# EAGLE design FeatherRTC (EAGLE 9.2.2)
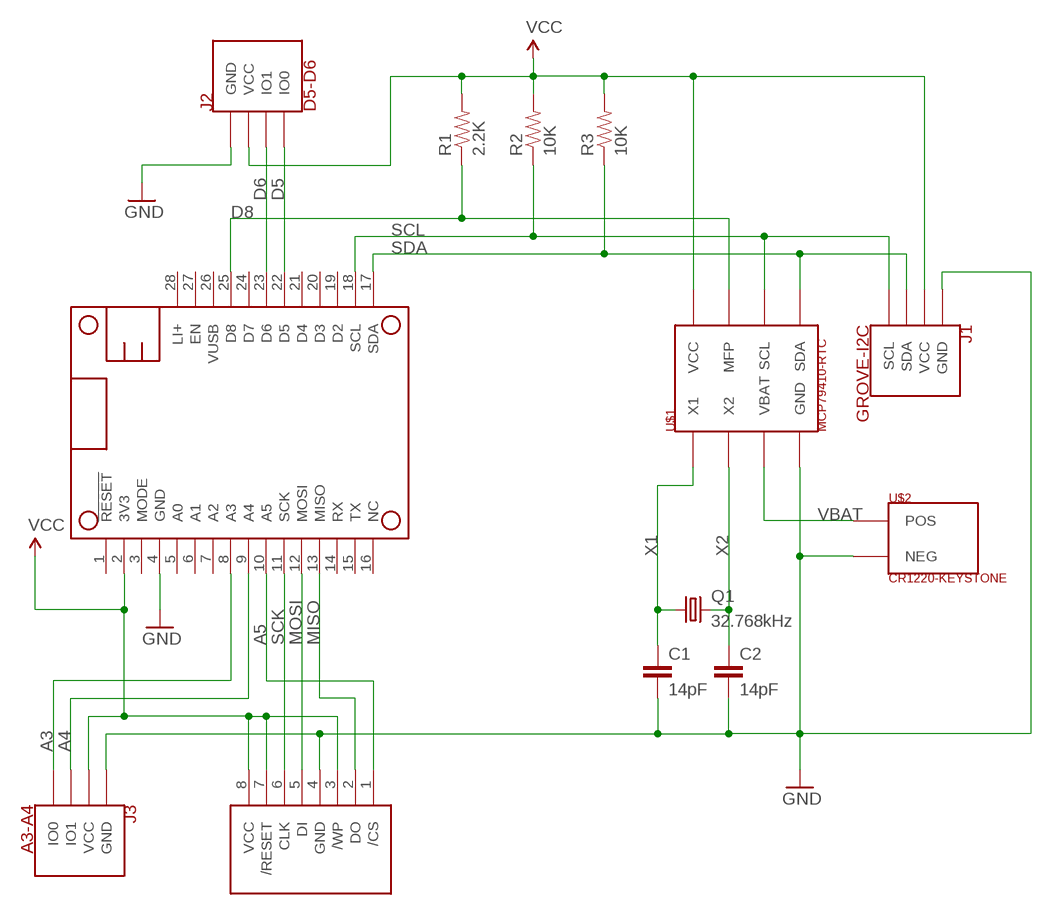
[diagram p0: schematic, sheet 1]

## Parts
C1  14pF  CAP-14PF-0603  [0603-CAP]
C2  14pF  CAP-14PF-0603  [0603-CAP]
J1  GROVE-I2C  [GROVE-VERT-PTH]
J2  D5-D6  GROVE-IO  [GROVE-VERT-PTH]
J3  A3-A4  GROVE-IO  [GROVE-VERT-PTH]
MS1  FEATHERWING_NODIM  [FEATHERWING_NODIM]
Q1  32.768kHz  FC-135-CRYSTAL  [FC-135]
R1  2.2K  RES-2K2-0805  [0805]
R2  10K  RES-10K-06030603  [0603-RES]
R3  10K  RES-10K-06030603  [0603-RES]
U$1  MCP79410-RTC  [8-SOIC-MICROCHIP-3.9]
U$2  CR1220-KEYSTONE  [CR1220-KEYSTONE]
U$3  W25Q-FLASH  [8-SOIC-WINBOND-208]

## Nets
A3: J3.1(IO0) MS1.8(A3)
A4: J3.2(IO1) MS1.9(A4)
A5: MS1.10(A5) U$3.1(/CS)
D5: J2.1(IO0) MS1.22(D5)
D6: J2.2(IO1) MS1.23(D6)
D8: MS1.25(D8) R1.1 U$1.7(MFP)
GND: C1.2 C2.2 J1.4(GND) J2.4(GND) J3.4(GND) MS1.4(GND) U$1.4(GND) U$2.NEG U$3.4(GND)
MISO: MS1.13(MISO) U$3.2(DO)
MOSI: MS1.12(MOSI) U$3.5(DI)
SCK: MS1.11(SCK) U$3.6(CLK)
SCL: J1.1(SCL) MS1.18(SCL) R2.1 U$1.6(SCL)
SDA: J1.2(SDA) MS1.17(SDA) R3.1 U$1.5(SDA)
VBAT: U$1.3(VBAT) U$2.POS
VCC: J1.3(VCC) J2.3(VCC) J3.3(VCC) MS1.2(3V3) R1.2 R2.2 R3.2 U$1.8(VCC) U$3.3(/WP) U$3.7(/RESET) U$3.8(VCC)
X1: C1.1 Q1.1 U$1.1(X1)
X2: C2.1 Q1.2 U$1.2(X2)
Unconnected: MS1.1(!RESET) MS1.3(MODE) MS1.5(A0) MS1.6(A1) MS1.7(A2) MS1.14(RX) MS1.15(TX) MS1.16(NC) MS1.19(D2) MS1.20(D3) MS1.21(D4) MS1.24(D7) MS1.26(VUSB) MS1.27(EN) MS1.28(LI+)

## Library data of the parts
C1 C2 = rickk2:CAP-14PF-0603: CAP CER 14PF 50V C0G/NP0 0603 14pF ±5% 50V Ceramic Capacitor C0G, NP0 0603 (1608 Metric) 100 for $2.82 https://www.digikey.com/product-detail/en/samsung-electro-mechanics/CL10C140JB8NNNC/1276-2187-1-ND/3890273
J1 = rickk2:GROVE-I2C: GROVE 2MM 4PIN CONN 10PACK $1.68 https://www.digikey.com/product-detail/en/seeed-technology-co-ltd/110990030/1597-1082-ND/5482560 GROVE 2MM 4PIN R/A CONN 10PACK $1.53 https://www.digikey.com/product-detail/en/seeed-technology-co-ltd/110990037/1597-1083-ND/5482561 Key on right Top 4 Black - GND 3 Red - VCC 2 White - SDA / TX / Secondary digital or analog 1 Yellow - SCL / RX / Primary digital or analog Bottom
J2 J3 = rickk2:GROVE-IO: GROVE 2MM 4PIN CONN 10PACK $1.68 https://www.digikey.com/product-detail/en/seeed-technology-co-ltd/110990030/1597-1082-ND/5482560 GROVE 2MM 4PIN R/A CONN 10PACK $1.53 https://www.digikey.com/product-detail/en/seeed-technology-co-ltd/110990037/1597-1083-ND/5482561 Key on right Top 4 Black - GND 3 Red - VCC 2 White - SDA / TX / Secondary digital or analog 1 Yellow - SCL / RX / Primary digital or analog Bottom
MS1 = Particle-Mesh:FEATHERWING
Q1 = rickk2:FC-135-CRYSTAL: EPSON FC-135 32.7680KA-AC0 $0.41 CRYSTAL 32.7680KHZ 9PF SMD 32.768kHz ±20ppm Crystal 9pF 70 kOhms 2-SMD, No Lead
R1 = rickk2:RES-2K2-0805: RES SMD 2.2K OHM 5% 1/8W 0805 $0.10 Not ordered yet - be sure to order if needed Panasonic ERJ-6GEYJ222V ±5% 0.125W, 1/8W Chip Resistor 0805 (2012 Metric) Automotive AEC-Q200 Thick Film https://www.digikey.com/product-detail/en/panasonic-electronic-components/ERJ-6GEYJ222V/P2.2KACT-ND/93214
R2 R3 = rickk2:RES-10K-0603: RES SMD 10K OHM 5% 1/4W 0603 $ 0.10 https://www.digikey.com/product-detail/en/panasonic-electronic-components/ERJ-PA3J103V/P10KBZCT-ND/5036237
U$1 = rickk2:MCP79410-RTC: Microchip Technology MCP79410-I/SN $0.93 IC RTC CLK/CALENDAR I2C 8-SOIC Real Time Clock (RTC) IC Clock/Calendar 64B, 1Kb I²C, 2-Wire Serial 8-SOIC (0.154", 3.90mm Width) https://www.digikey.com/product-detail/en/microchip-technology/MCP79410-I-SN/MCP79410-I-SN-ND/2480419
U$2 = rickk2:CR1220-KEYSTONE: Keystone Electronics 1056TR $ 1.09 BATTERY HOLDER COIN 12.5MM SMD https://www.digikey.com/product-detail/en/keystone-electronics/1056TR/36-1056TR-ND/2746328
U$3 = rickk2:W25Q-FLASH: 8Mbit (1M x 8-bit) $0.41 https://www.digikey.com/product-detail/en/winbond-electronics/W25Q80DVSSIG/W25Q80DVSSIG-ND/4836572 16Mbit $0.68 https://www.digikey.com/product-detail/en/winbond-electronics/W25Q16FWSSIQ/W25Q16FWSSIQ-ND/5803950 32Mbit $0.78 Winbond W25Q32JV IC FLASH 32MBIT 133MHZ 8SOP FLASH - NOR Memory IC 32Mb (4M x 8) SPI 133MHz 8-SOIC 8-SOIC (0.209", 5.30mm Width) 2.7 V ~ 3.6 V 133 Mhz https://www.digikey.com/product-detail/en/winbond-electronics/W25Q32JVSSIQ/W25Q32JVSSIQ-ND/5803981 64 Mbit $1.41 https://www.digikey.com/product-detail/en/winbond-electronics/W25Q64FWSSIG/W25Q64FWSSIG-ND/4037479 128 Mbit $ 1.75 https://www.digikey.com/product-detail/en/winbond-electronics/W25Q128JVSIQ/W25Q128JVSIQ-ND/5803943

## Board
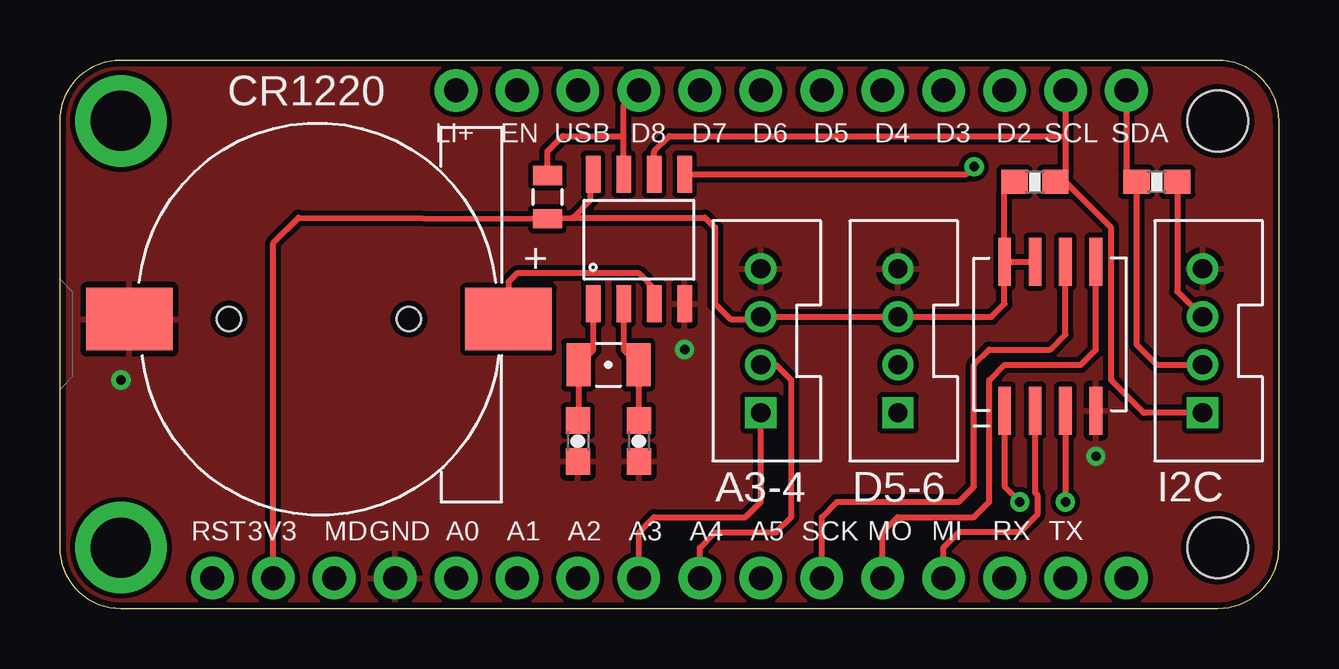
[diagram p1: board, top side]
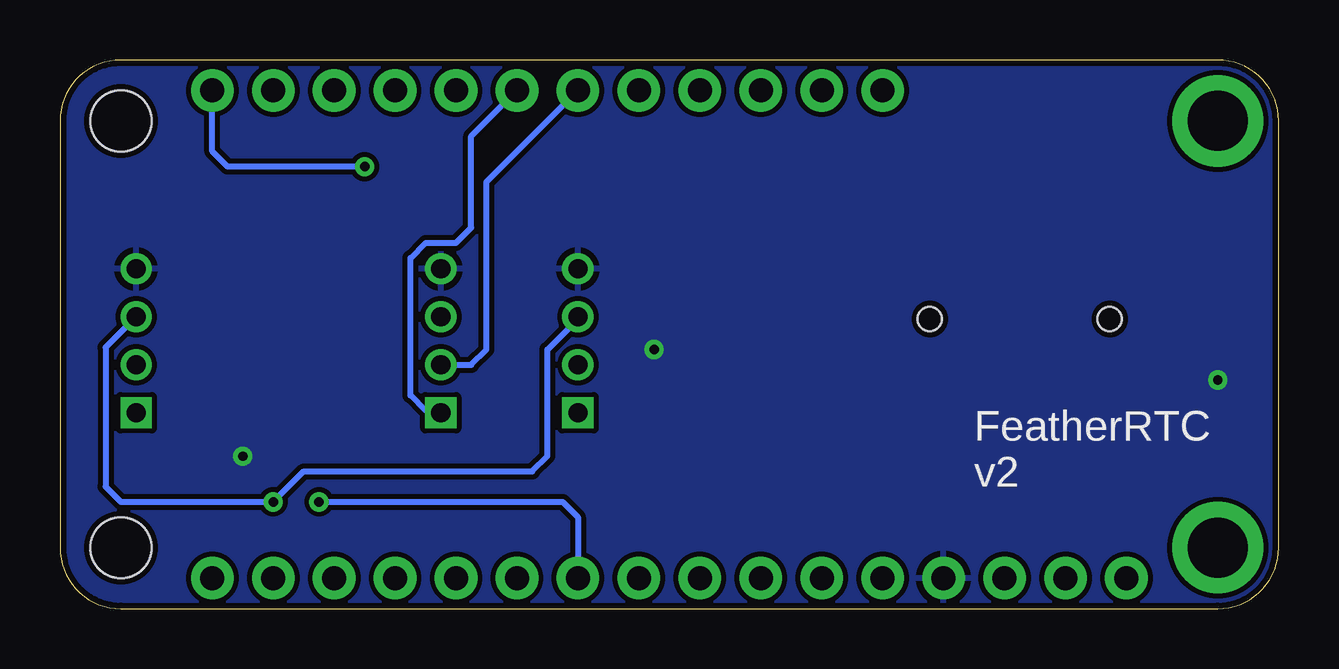
[diagram p2: board, bottom side, seen from below]

Size 50.8 x 22.86 mm. Coordinates in mm from the lower left corner, seen from the top.
Outline: 2.54,22.86 48.26,22.86 arc-90 50.8,20.32 50.8,2.54 arc-90 48.26,0 2.54,0 arc-90 0,2.54 0,20.32 arc-90 2.54,22.86
Copper layers (1*16): Top 0.035mm / dielectric 1.5mm / Bottom 0.035mm
Design rules "adafruit": minimum track width 8mil, minimum drill 15.5mil, track to track 8mil, track to pad 8mil, pad to pad 8mil, via to via 8mil, smd to smd 8mil, copper to edge 10mil, drill to drill 8mil, minimum pad ring 10mil, minimum via ring 8mil, stop-mask expansion 2mil, vias tented up to drill 20mil, thermal gap 10mil

### Footprints (pad centres in the part's own frame; a part is rotated, then mirrored left to right if it is on the bottom)
0603-CAP = smd 1.1 x 1: 1 -0.85,0; 2 0.85,0
GROVE-VERT-PTH = drill 0.8 square: 1 -2,0 | drill 0.8: 2 0,0; 3 2,0; 4 4,0
FEATHERWING_NODIM = drill 1 pad 1.778: 1 6.35,1.27; 2 8.89,1.27; 3 11.43,1.27; 4 13.97,1.27; 5 16.51,1.27; 6 19.05,1.27; 7 21.59,1.27; 8 24.13,1.27; 9 26.67,1.27; 10 29.21,1.27; 11 31.75,1.27; 12 34.29,1.27; 13 36.83,1.27; 14 39.37,1.27; 15 41.91,1.27; 16 44.45,1.27; 17 44.45,21.59; 18 41.91,21.59; 19 39.37,21.59; 20 36.83,21.59; 21 34.29,21.59; 22 31.75,21.59; 23 29.21,21.59; 24 26.67,21.59; 25 24.13,21.59; 26 21.59,21.59; 27 19.05,21.59; 28 16.51,21.59 | drill 2.5 pad 3.81: P$1 2.54,20.32; P$2 2.54,2.54 | hole 2.54: 48.26,20.32; 48.26,2.54
FC-135 = smd 1 x 1.8: 1 -1.25,0; 2 1.25,0
0805 = smd 0.8 x 1.2: 1 -0.9,0; 2 0.9,0
0603-RES = smd 1.1 x 1: 1 -0.85,0; 2 0.85,0
8-SOIC-MICROCHIP-3.9 = smd 0.6 x 1.55: 1 0,0; 2 1.27,0; 3 2.54,0; 4 3.81,0; 5 3.81,5.4; 6 2.54,5.4; 7 1.27,5.4; 8 0,5.4
CR1220-KEYSTONE = smd 3.6 x 2.6: NEG -7.9,0; POS 7.9,0 | hole 1: -3.75,0; 3.75,0
8-SOIC-WINBOND-208 = smd 0.53 x 2: 1 0,0; 2 1.27,0; 3 2.54,0; 4 3.81,0; 5 3.81,6.2; 6 2.54,6.2; 7 1.27,6.2; 8 0,6.2

### Placement (x,y rotation side)
C1  21.59,6.99 270 top
C2  24.13,6.99 270 top
J1  47.62,10.16 90 top
J2  34.92,10.16 90 top
J3  29.21,10.16 90 top
MS1  0,0 0 top
Q1  22.86,10.16 0 top
R1  20.32,17.14 270 top
R2  40.64,17.78 180 top
R3  45.72,17.78 0 top
U$1  22.23,12.7 0 top
U$2  10.79,12.06 0 top
U$3  39.37,8.26 0 top

### Tracks (layer width: path | path; a pad name or v marks a point on that pad's centre or on a via)
A3
  Top 0.254: MS1.8 24.13,3.17 24.77,3.81 28.57,3.81 29.21,4.45 J3.1
A4
  Top 0.254: MS1.9 26.67,2.54 27.3,3.17 29.84,3.17 30.48,3.81 30.48,9.53 29.84,10.16 J3.2
A5  (via drill 0.39)
  Top 0.254: v40.01,4.45 39.37,5.08 U$3.1
  Bottom 0.254: v40.01,4.45 29.84,4.45 29.21,3.81 MS1.10
D5
  Bottom 0.254: J2.1 35.02,8.26 35.56,8.26 36.2,8.89 36.2,14.61 35.56,15.24 34.29,15.24 33.66,15.88 33.66,19.68 MS1.22
D6
  Bottom 0.254: J2.2 33.66,10.16 33.02,10.79 33.02,17.78 MS1.23
D8
  Top 0.254: U$1.7 23.5,19.68 | 23.5,19.68 23.5,20.95 MS1.25 | R1.1 20.32,19.05 20.95,19.68 23.5,19.68
GND  (via drill 0.39)
  other vias: 26.04,10.79 2.54,9.53 43.18,6.35
  pour Top: 0,0 0,30.48 55.88,30.48 55.88,0
  pour Bottom: 0,0 0,33.02 53.34,33.02 53.34,0
MISO
  Top 0.254: MS1.13 36.83,2.54 37.47,3.17 40.01,3.17 40.73,3.9 40.73,4.75 40.64,4.84 U$3.2
MOSI
  Top 0.254: MS1.12 34.29,3.17 34.92,3.81 38.1,3.81 38.73,4.45 38.73,9.53 39.37,10.16 42.55,10.16 43.18,10.79 U$3.5
SCK
  Top 0.254: MS1.11 31.75,3.81 32.38,4.45 37.47,4.45 38.1,5.08 38.1,10.16 38.73,10.79 41.27,10.79 41.91,11.43 U$3.6
SCL
  Top 0.254: J1.1 45.18,8.16 43.81,9.53 43.81,15.88 41.91,17.78 R2.1 41.91,18.2 41.91,19.68 | MS1.18 41.91,19.68 | U$1.6 24.77,19.05 25.4,19.68 41.91,19.68
SDA  (via drill 0.39)
  Top 0.254: MS1.17 44.45,18.2 R3.1 44.87,11.01 45.72,10.16 J1.2 | U$1.5 37.78,18.1 v38.1,18.41
  Bottom 0.254: v38.1,18.41 43.81,18.41 44.45,19.05 MS1.17
VBAT
  Top 0.254: U$1.3 24.77,13.34 24.13,13.97 19.05,13.97 18.7,13.62 U$2.POS
VCC  (via drill 0.39)
  Top 0.254: U$1.8 22.12,18 22.12,17.04 21.38,16.3 | MS1.2 8.89,15.24 9.95,16.3 R1.2 21.38,16.3 | 21.38,16.3 26.89,16.3 27.3,15.88 27.3,12.7 27.94,12.06 29.11,12.06 J3.3 J2.3 38.83,12.16 39.37,12.7 U$3.8 | R2.2 39.37,17.36 U$3.8 | U$3.8 U$3.7 | U$3.3 v41.91,4.45 | R3.2 46.57,13.21 J1.3
  Bottom 0.254: J3.3 29.21,12.06 30.48,10.79 30.48,6.35 31.11,5.71 40.64,5.71 v41.91,4.45 48.26,4.45 48.9,5.08 48.9,10.89 J1.3
X1
  Top 0.254: C1.1 21.61,7.86 Q1.1 22.23,10.78 U$1.1
X2
  Top 0.254: U$1.2 23.5,10.78 Q1.2 24.11,7.86 C2.1

### Text on the board
tPlace: CR1220 | LI+ | EN | USB | D8 | D7 | D6 | D5 | D4 | D3 | D2 | SCL | SDA | A3-4 | D5-6 | I2C | RST | 3V3 | MD | GND | A0 | A1 | A2 | A3 | A4 | A5 | SCK | MO | MI | RX | TX
bPlace: FeatherRTC / v2
Document: 10K | 10K | 2.2K | MCP79410 | 32.768 | W25Q32 | 14pF | 14pF